# Altium schematic sheet UF_Servo.SchDoc: UF Servo
size A3; Author: M.Beldyga; CompanyName: WUT ISE; DrawnBy: M.Beldyga; Organization: WUT ISE; Address1: PW ISE; Address2: Nowowiejska 15/19 00-665 Warsaw; Address3: micbeldyga@gmail.com; SheetNumber: 1; SheetTotal: 12; ModifiedBy: -; CheckedDate: -; Title2: Low latency PID controller; DivGrp: WUT ISE; Designer: M.Beldyga; ModifiedDate: -; ProjectName: Sensor Box
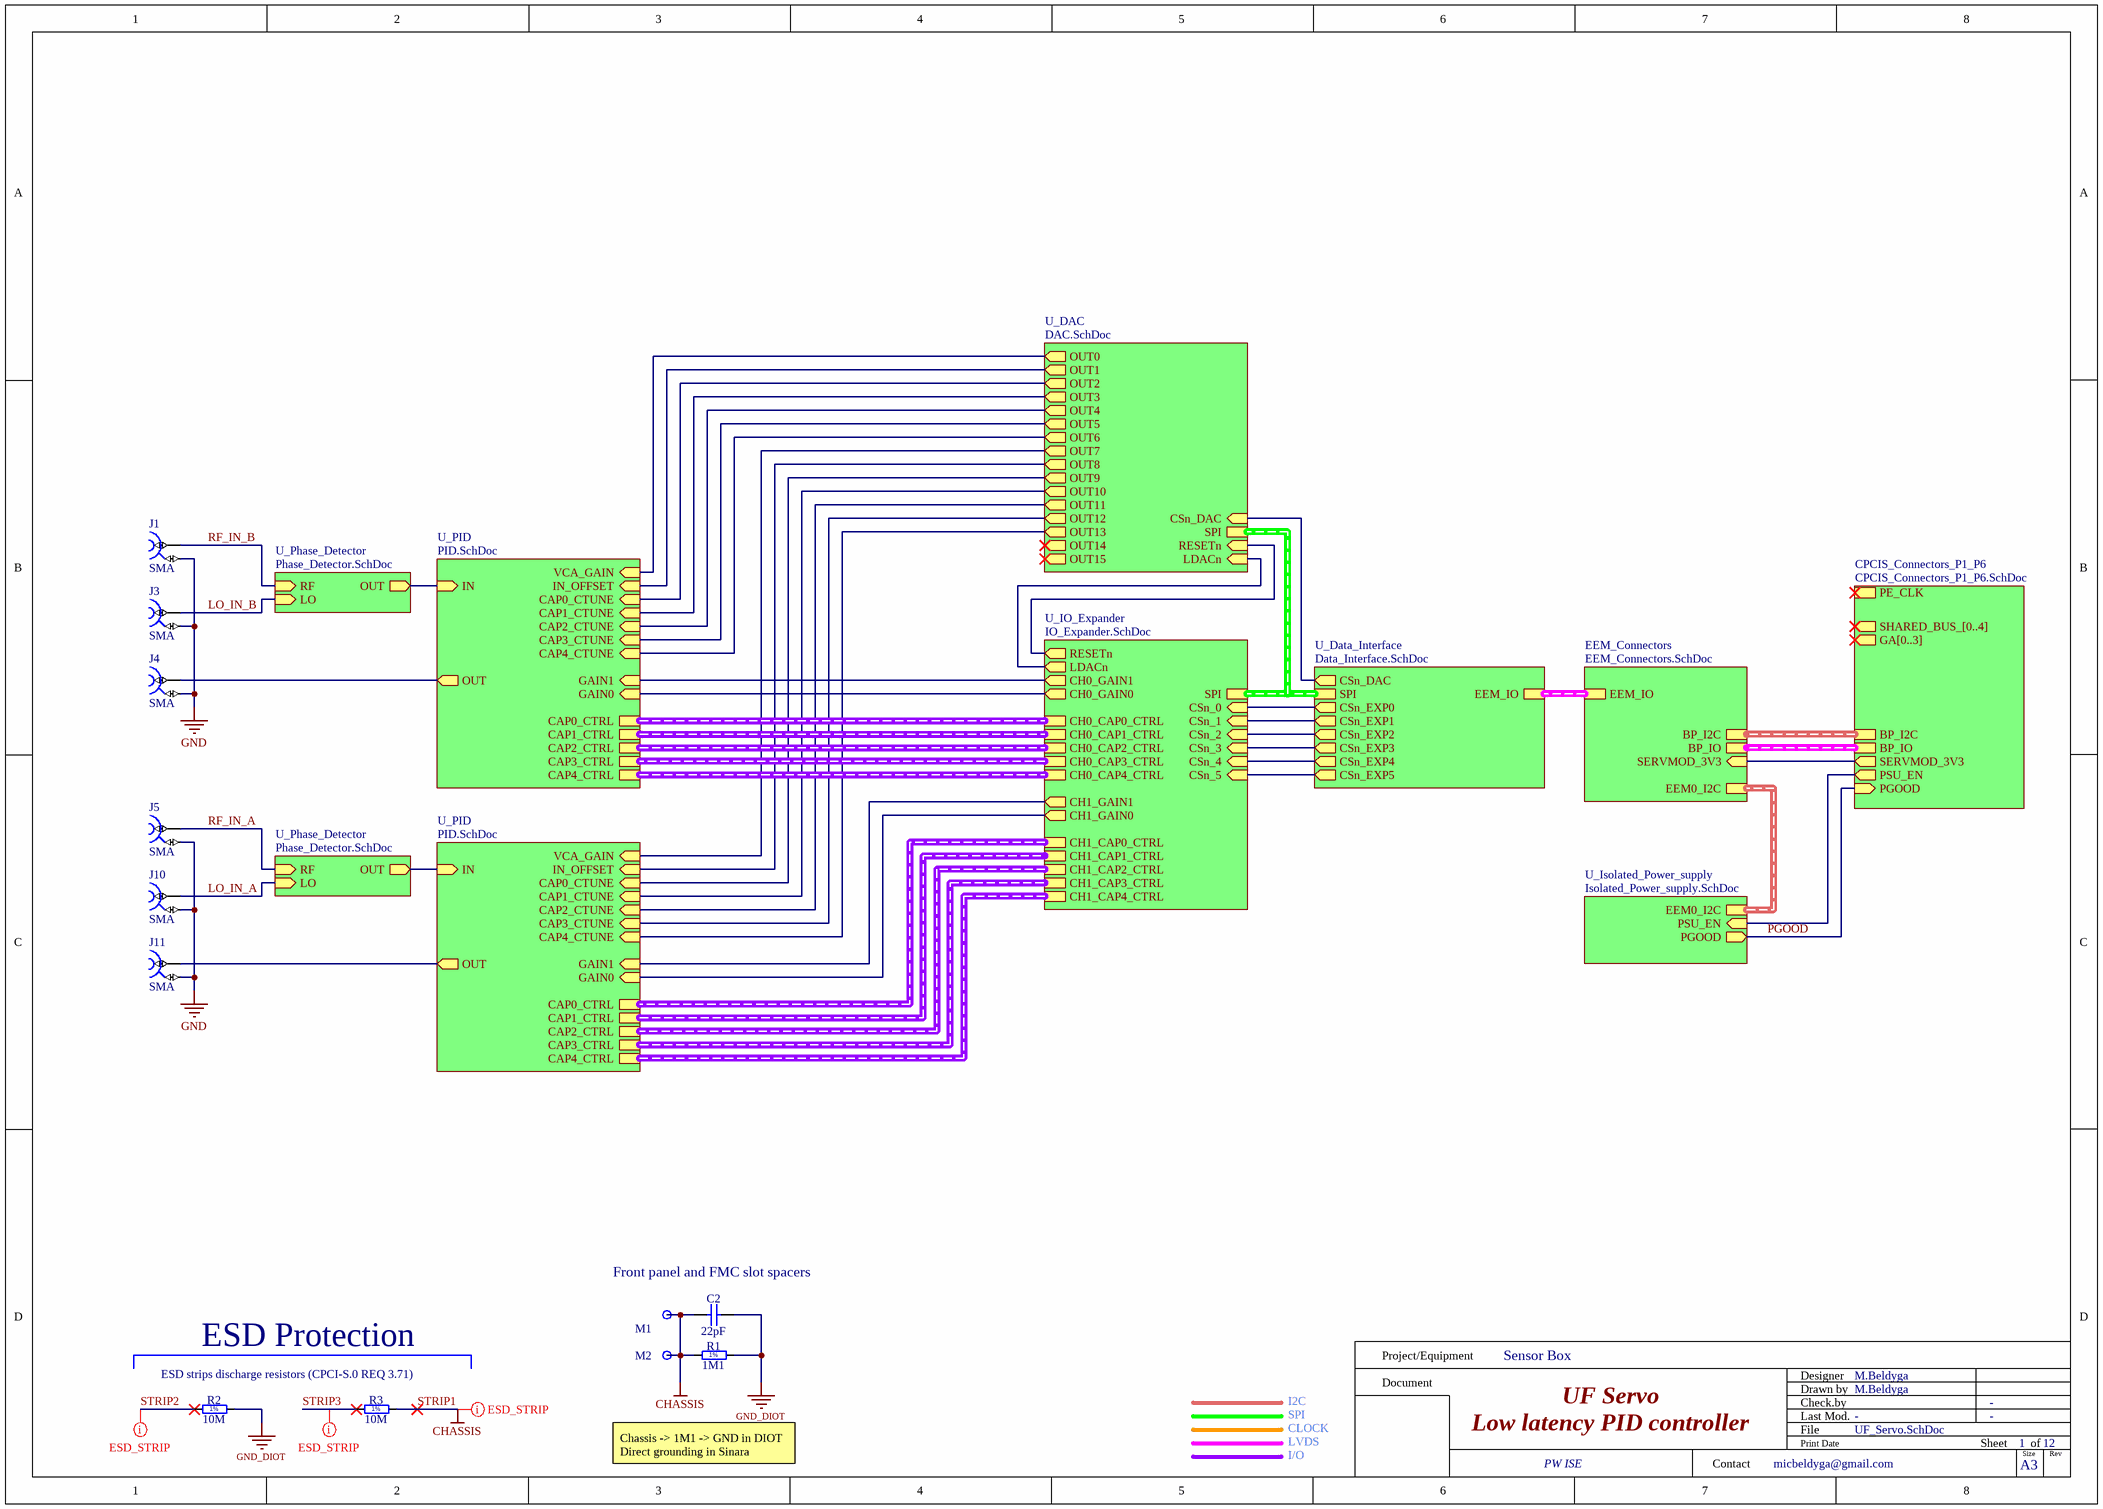
[diagram p0: UF_Servo.SchDoc]

## Parts
C2  22pF  [CAPC1005X55N]
J1  SMA  [AMPHENOL_132203-12]
J3  SMA  [AMPHENOL_132203-12]
J4  SMA  [AMPHENOL_132203-12]
J5  SMA  [AMPHENOL_132203-12]
J10  SMA  [AMPHENOL_132203-12]
J11  SMA  [AMPHENOL_132203-12]
M1  Plated Hole  [MTG300_600]  (value not drawn)  (no BOM)
M2  Plated Hole  [MTG300_600]  (value not drawn)  (no BOM)
R1  1M1  [RESC2012X60N]
R2  10M  [RESC2113X55N]
R3  10M  [RESC2113X55N]

## Sub-sheets
CPCIS_Connectors_P1_P6 = CPCIS_Connectors_P1_P6.SchDoc: BP_I2C (harness I2C), SERVMOD_3V3 (out), PSU_EN (out), PE_CLK (harness CLK_DIFF), GA[0..3] (out), BP_IO (harness EEM_LVDS), SHARED_BUS_[0..4] (out), PGOOD (in)
EEM_Connectors = EEM_Connectors.SchDoc: EEM_IO (harness EEM_LVDS), BP_IO (harness EEM_LVDS), EEM0_I2C (harness I2C), BP_I2C (harness I2C), SERVMOD_3V3 (in)
U_DAC = DAC.SchDoc: SPI (harness SPI), CSn_DAC (in), OUT0 (out), OUT1 (out), OUT2 (out), OUT3 (out), OUT4 (out), OUT5 (out), OUT6 (out), OUT7 (out), OUT8 (out), OUT9 (out), OUT10 (out), OUT11 (out), OUT12 (out), OUT13 (out), OUT14 (out), OUT15 (out), RESETn (in), LDACn (in)
U_Data_Interface = Data_Interface.SchDoc: SPI (harness SPI), EEM_IO (harness EEM_LVDS), CSn_DAC (out), CSn_EXP0 (out), CSn_EXP1 (out), CSn_EXP2 (out), CSn_EXP3 (out), CSn_EXP4 (out), CSn_EXP5 (out)
U_IO_Expander = IO_Expander.SchDoc: CSn_0 (in), CSn_1 (in), CSn_2 (in), CSn_3 (in), CSn_4 (in), SPI (harness SPI), CH0_CAP1_CTRL (harness CAP_CTRL), CH0_CAP2_CTRL (harness CAP_CTRL), CH0_CAP3_CTRL (harness CAP_CTRL), CH0_CAP4_CTRL (harness CAP_CTRL), CH0_CAP0_CTRL (harness CAP_CTRL), CH0_GAIN0 (out), CH0_GAIN1 (out), RESETn (out), LDACn (out), CH1_CAP1_CTRL (harness CAP_CTRL), CH1_CAP2_CTRL (harness CAP_CTRL), CH1_CAP3_CTRL (harness CAP_CTRL), CH1_CAP4_CTRL (harness CAP_CTRL), CH1_CAP0_CTRL (harness CAP_CTRL), CH1_GAIN0 (out), CH1_GAIN1 (out), CSn_5 (in)
U_Isolated_Power_supply = Isolated_Power_supply.SchDoc: PSU_EN (in), EEM0_I2C (harness I2C), PGOOD (out)
U_Phase_Detector = Phase_Detector.SchDoc: OUT (out), RF (in), LO (in)
U_Phase_Detector = Phase_Detector.SchDoc: OUT (out), RF (in), LO (in)
U_PID = PID.SchDoc: GAIN1 (in), GAIN0 (in), IN (in), OUT (out), VCA_GAIN (in), IN_OFFSET (in), CAP0_CTUNE (in), CAP1_CTUNE (in), CAP2_CTUNE (in), CAP3_CTUNE (in), CAP4_CTUNE (in), CAP0_CTRL (harness CAP_CTRL), CAP1_CTRL (harness CAP_ctrl), CAP3_CTRL (harness CAP_CTRL), CAP4_CTRL (harness CAP_CTRL), CAP2_CTRL (harness CAP_ctrl)
U_PID = PID.SchDoc: GAIN1 (in), GAIN0 (in), IN (in), OUT (out), VCA_GAIN (in), IN_OFFSET (in), CAP0_CTUNE (in), CAP1_CTUNE (in), CAP2_CTUNE (in), CAP3_CTUNE (in), CAP4_CTUNE (in), CAP0_CTRL (harness CAP_CTRL), CAP1_CTRL (harness CAP_ctrl), CAP3_CTRL (harness CAP_CTRL), CAP4_CTRL (harness CAP_CTRL), CAP2_CTRL (harness CAP_ctrl)

## Nets
GND: J1.2 J3.2 J4.2 J5.2 J10.2 J11.2
GND_DIOT: C2.2 R1.2 R2.2
STRIP1: C2.1 M1.1 M2.1 R1.1 R3.2  [also labelled CHASSIS]
LO_IN_A: J10.1 ; sheet U_Phase_Detector/LO
LO_IN_B: J3.1 ; sheet U_Phase_Detector/LO
PGOOD: sheet CPCIS_Connectors_P1_P6/PGOOD, sheet U_Isolated_Power_supply/PGOOD
RF_IN_A: J5.1 ; sheet U_Phase_Detector/RF
RF_IN_B: J1.1 ; sheet U_Phase_Detector/RF
STRIP2: R2.1
STRIP3: R3.1
NetJ4_1: J4.1 ; sheet U_PID/OUT
NetJ11_1: J11.1 ; sheet U_PID/OUT
(unnamed): sheet U_PID/GAIN1, sheet U_IO_Expander/CH0_GAIN1
(unnamed): sheet U_PID/GAIN0, sheet U_IO_Expander/CH0_GAIN0
(unnamed): sheet U_PID/IN, sheet U_Phase_Detector/OUT
(unnamed): sheet U_PID/VCA_GAIN, sheet U_DAC/OUT0
(unnamed): sheet U_PID/IN_OFFSET, sheet U_DAC/OUT1
(unnamed): sheet U_PID/CAP0_CTUNE, sheet U_DAC/OUT2
(unnamed): sheet U_PID/CAP1_CTUNE, sheet U_DAC/OUT3
(unnamed): sheet U_PID/CAP2_CTUNE, sheet U_DAC/OUT4
(unnamed): sheet U_PID/CAP3_CTUNE, sheet U_DAC/OUT5
(unnamed): sheet U_PID/CAP4_CTUNE, sheet U_DAC/OUT6
(unnamed): sheet U_IO_Expander/CSn_0, sheet U_Data_Interface/CSn_EXP0
(unnamed): sheet U_IO_Expander/CSn_1, sheet U_Data_Interface/CSn_EXP1
(unnamed): sheet U_IO_Expander/CSn_2, sheet U_Data_Interface/CSn_EXP2
(unnamed): sheet U_IO_Expander/CSn_3, sheet U_Data_Interface/CSn_EXP3
(unnamed): sheet U_IO_Expander/CSn_4, sheet U_Data_Interface/CSn_EXP4
(unnamed): sheet U_IO_Expander/RESETn, sheet U_DAC/RESETn
(unnamed): sheet U_IO_Expander/LDACn, sheet U_DAC/LDACn
(unnamed): sheet U_IO_Expander/CH1_GAIN0, sheet U_PID/GAIN0
(unnamed): sheet U_IO_Expander/CH1_GAIN1, sheet U_PID/GAIN1
(unnamed): sheet U_IO_Expander/CSn_5, sheet U_Data_Interface/CSn_EXP5
(unnamed): sheet CPCIS_Connectors_P1_P6/SERVMOD_3V3, sheet EEM_Connectors/SERVMOD_3V3
(unnamed): sheet CPCIS_Connectors_P1_P6/PSU_EN, sheet U_Isolated_Power_supply/PSU_EN
(unnamed): sheet U_Data_Interface/CSn_DAC, sheet U_DAC/CSn_DAC
(unnamed): sheet U_DAC/OUT7, sheet U_PID/VCA_GAIN
(unnamed): sheet U_DAC/OUT8, sheet U_PID/IN_OFFSET
(unnamed): sheet U_DAC/OUT9, sheet U_PID/CAP0_CTUNE
(unnamed): sheet U_DAC/OUT10, sheet U_PID/CAP1_CTUNE
(unnamed): sheet U_DAC/OUT11, sheet U_PID/CAP2_CTUNE
(unnamed): sheet U_DAC/OUT12, sheet U_PID/CAP3_CTUNE
(unnamed): sheet U_DAC/OUT13, sheet U_PID/CAP4_CTUNE
(unnamed): sheet U_PID/IN, sheet U_Phase_Detector/OUT

## Buses and harness runs
harness sheet CPCIS_Connectors_P1_P6/BP_I2C = sheet EEM_Connectors/BP_I2C
harness sheet CPCIS_Connectors_P1_P6/BP_IO = sheet EEM_Connectors/BP_IO
harness sheet EEM_Connectors/EEM0_I2C = sheet U_Isolated_Power_supply/EEM0_I2C
harness sheet EEM_Connectors/EEM_IO = sheet U_Data_Interface/EEM_IO
harness sheet U_DAC/SPI = sheet U_Data_Interface/SPI = sheet U_IO_Expander/SPI
harness sheet U_IO_Expander/CH0_CAP0_CTRL = sheet U_PID/CAP0_CTRL
harness sheet U_IO_Expander/CH0_CAP1_CTRL = sheet U_PID/CAP1_CTRL
harness sheet U_IO_Expander/CH0_CAP2_CTRL = sheet U_PID/CAP2_CTRL
harness sheet U_IO_Expander/CH0_CAP3_CTRL = sheet U_PID/CAP3_CTRL
harness sheet U_IO_Expander/CH0_CAP4_CTRL = sheet U_PID/CAP4_CTRL
harness sheet U_IO_Expander/CH1_CAP0_CTRL = sheet U_PID/CAP0_CTRL
harness sheet U_IO_Expander/CH1_CAP1_CTRL = sheet U_PID/CAP1_CTRL
harness sheet U_IO_Expander/CH1_CAP2_CTRL = sheet U_PID/CAP2_CTRL
harness sheet U_IO_Expander/CH1_CAP3_CTRL = sheet U_PID/CAP3_CTRL
harness sheet U_IO_Expander/CH1_CAP4_CTRL = sheet U_PID/CAP4_CTRL

## Layout directives
net class ESD_STRIP: STRIP1, STRIP2, STRIP3

## Notes on the sheet
- Front panel and FMC slot spacers
- ESD strips discharge resistors (CPCI-S.0 REQ 3.71)
- ESD Protection
- Chassis -> 1M1 -> GND in DIOT
  Direct grounding in Sinara
- I2C
- SPI
- CLOCK
- LVDS
- I/O
- Project/Equipment
- Document
- Designer
- Drawn by
- Check.by
- Contact
- File
- Last Mod.
- Print Date
- Sheet
- Size
- A3
- of
- Rev
- (in symbol R0805_1M1_1%_0.125W_100PPM) 1%
- (in symbol R0805_10M_1%_0.125W_100PPM_VISHAY_CRCW e3) 1%

## Library data of the parts
C2 = CC0402_22PF_50V_5%_C0G: Non-polarised capacitor; Part Description: SMD Multilayer Chip Ceramic Capacitor; Manufacturer: GENERIC; Manufacturer1 Part Number: C0402C220J5GACTU; Voltage: 50V; TC: C0G/NP0; Tolerance: ±5%; Part Number: CC0402_22PF_50V_5%_C0G; Component Kind: Standard; Component Type: Standard; Pin Count: 2; Value: 22pF; Status: Preferred; Manufacturer Part Number: CC0402_22PF_50V_5%_C0G; Case: 0402; Mounted: Yes; Socket: No; SMD: Yes; Manufacturer1 Example: KEMET; Manufacturer1 ComponentHeight: 0.55mm; HelpURL: \\cern.ch\dfs\Applications\Altium\Datasheets\CC0402_C0G_KEMET_(Commercial Grade).pdf; Author: CERN DEM JLC; CreateDate: 2007-12-03; LatestRevisionDate: 2007-12-03; Sense: No
J1 J3-J5 J10 J11 = 132203-12: RF Connector SMA Right Angle PCB Jack Through Hole 50 Ohm Bulkhead; Manufacturer: Amphenol Connex; Supplier: Mouser; Supplier Part Number: 523-132203-12; Manufacturer Part Number: 132203-12; RoHS: Yes; Category: RF / Coaxial Connectors; Stock: 515; Pricing: 1=20.22, 10=18.65, 50=18.65, 100=18.65, 1000=18.65, 10000=18.65 (USD); ComponentLink1URL: https://datasheet.ciiva.com/24241/132203-12-customer-drawing-24241088.pdf?src-supplier=Mouser; ComponentLink1Description: https://datasheet.ciiva.com/24241/132203-12-customer-drawing-24241088.pdf?src-supplier=Mouser; ComponentLink2URL: https://datasheet.ciiva.com/647/132203-12-647032.pdf?src-supplier=Digikey; ComponentLink2Description: https://datasheet.ciiva.com/647/132203-12-647032.pdf?src-supplier=Digikey
M1 M2 = PLATED_HOLE3.0_PAD6.0: Single Terminal Socket; Part Description: Plated Through Hole: Hole Dia.=3.0mm Pad Dia.=6.0mm; Mounted: No; Table: Pads; Part Number: PLATED_HOLE3.0_PAD6.0; Component Type: Standard (No BOM); Designator: Single Terminal Socket; Library Reference: Single Terminal Socket; Pin Count: 1; Family: Plated Hole; Socket: No; SMD: No; Status: None; ComponentHeight: 0mm; Author: CERN DEM JLC; CreateDate: 26.05.2008; LatestRevisionDate: 26.05.2008; PackageDescription: Plated Through Hole: Hole Dia.=3.0mm Pad Dia.=6.0mm
R1 = R0805_1M1_1%_0.125W_100PPM: Resistor - 1%; Part Description: General Purpose Thick Film Chip Resistor; Manufacturer: GENERIC; Manufacturer1 Part Number: NRC10F1104TRF; PressFit: No; Part Number: R0805_1M1_1%_0.125W_100PPM; Component Kind: Standard; Component Type: Standard; Pin Count: 2; Value: 1M1; Status: Preferred; Manufacturer Part Number: R0805_1M1_1%_0.125W_100PPM; Case: 0805; Mounted: Yes; Sense: No; Socket: No; SMD: Yes; Manufacturer1 Example: NIC COMPONENT; Manufacturer1 ComponentHeight: 0.6mm; HelpURL: \\cern.ch\dfs\Applications\Altium\Datasheets\R0805_NIC_NRC.pdf; Author: CERN DEM JLC; CreateDate: 03/12/2007; LatestRevisionDate: 13/03/2008
R2 R3 = R0805_10M_1%_0.125W_100PPM_VISHAY_CRCW e3: Resistor - 1%; Part Description: 150V, Standard Thick Film Chip Resistor; Manufacturer: VISHAY DALE; Manufacturer Part Number: CRCW080510M0FKEA; Power: 0.125W; TC: ±100ppm/°C; PressFit: No; Part Number: R0805_10M_1%_0.125W_100PPM_VISHAY_CRCW e3; Component Kind: Standard; Component Type: Standard; Pin Count: 2; Value: 10M; Status: None; Tolerance: ±1%; Case: 0805; Mounted: Yes; Sense: No; Socket: No; SMD: Yes; ComponentHeight: 0.5mm; HelpURL: \\cern.ch\dfs\Applications\Altium\Datasheets\R0805_VISHAY_CRCW e3.pdf; Author: CERN DEM BC; CreateDate: 2019-11-12; LatestRevisionDate: 2019-11-12